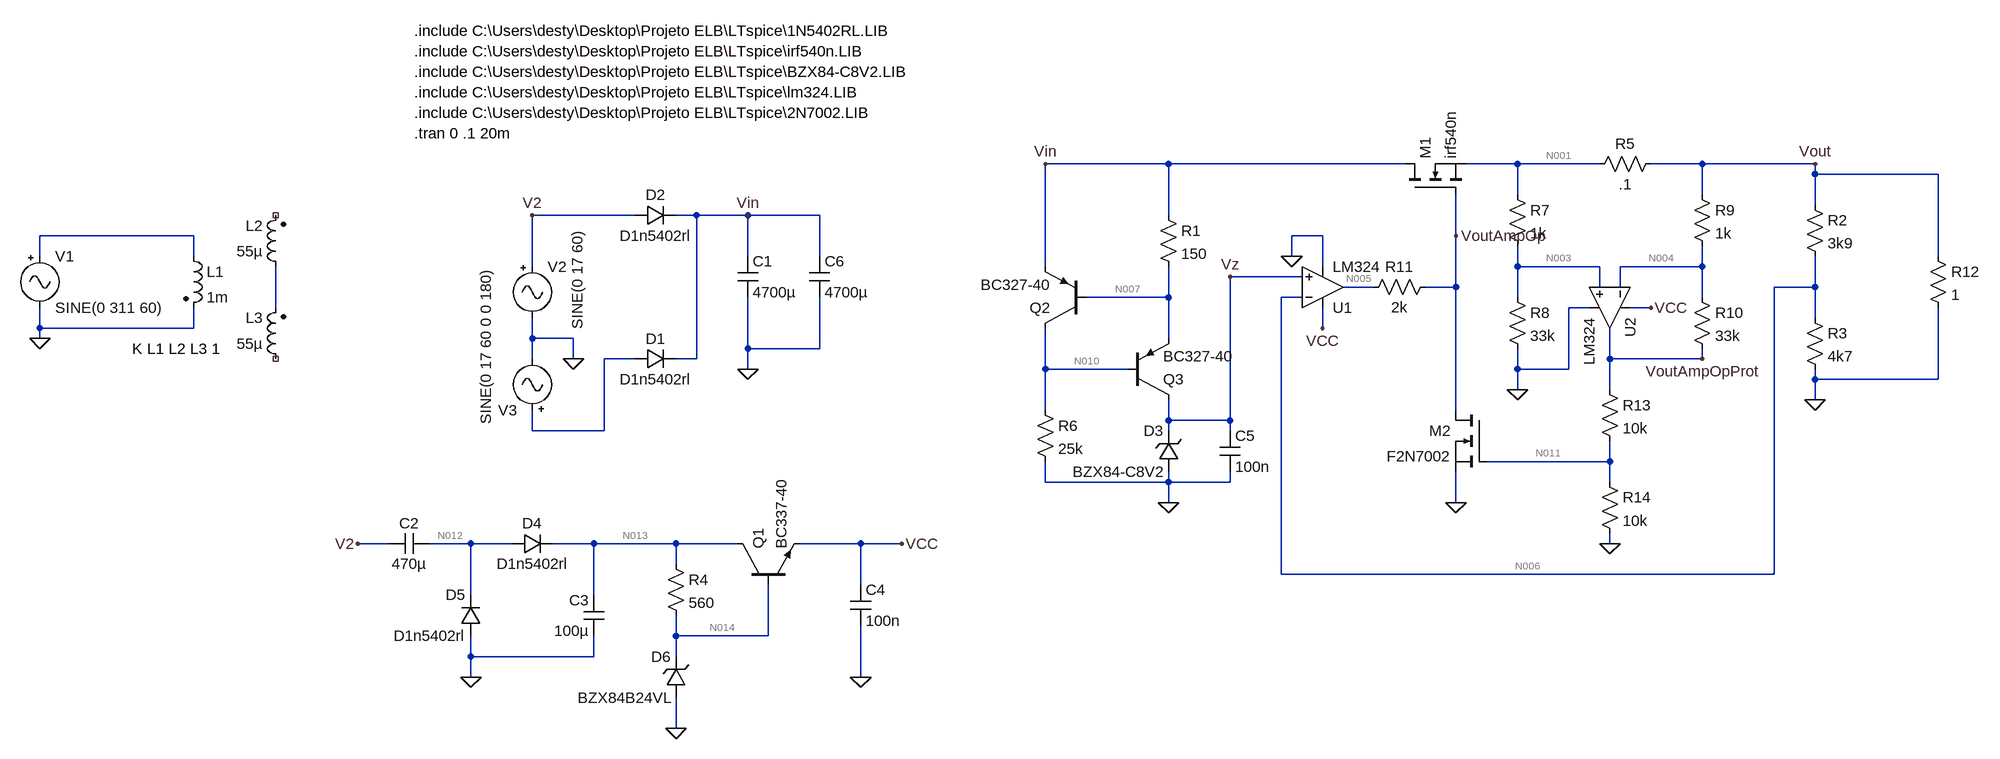
[diagram p0: schematic Projeto ELB.asc]
Projeto ELB.asc, the LTspice schematic file:
Version 4
SHEET 1 2556 872
WIRE 1280 -32 1088 -32
WIRE 1648 -32 1280 -32
WIRE 1824 -32 1744 -32
WIRE 1952 -32 1824 -32
WIRE 2112 -32 2032 -32
WIRE 2288 -32 2112 -32
WIRE 2288 -16 2288 -32
WIRE 2480 -16 2288 -16
WIRE 1824 16 1824 -32
WIRE 2112 16 2112 -32
WIRE 2288 32 2288 -16
WIRE 448 48 288 48
WIRE 544 48 512 48
WIRE 624 48 544 48
WIRE 736 48 624 48
WIRE 1280 48 1280 -32
WIRE -240 80 -480 80
WIRE 1520 80 1472 80
WIRE 1728 80 1728 16
WIRE -480 112 -480 80
WIRE -240 112 -240 80
WIRE 624 112 624 48
WIRE 736 112 736 48
WIRE 1472 112 1472 80
WIRE 2480 112 2480 -16
WIRE 288 128 288 48
WIRE 1088 128 1088 -32
WIRE 1520 128 1520 80
WIRE 1824 128 1824 96
WIRE 1952 128 1824 128
WIRE 2112 128 2112 96
WIRE 2112 128 1984 128
WIRE 1488 144 1376 144
WIRE 1600 160 1552 160
WIRE 1728 160 1728 80
WIRE 1728 160 1680 160
WIRE 1952 160 1952 128
WIRE 1984 160 1984 128
WIRE 2288 160 2288 112
WIRE 2288 160 2224 160
WIRE 1280 176 1280 128
WIRE 1280 176 1152 176
WIRE 1488 176 1456 176
WIRE 1824 176 1824 128
WIRE 2112 176 2112 128
WIRE -112 192 -112 128
WIRE 1936 192 1904 192
WIRE 2032 192 2000 192
WIRE 2288 208 2288 160
WIRE -480 224 -480 192
WIRE -240 224 -240 192
WIRE -240 224 -480 224
WIRE 1520 224 1520 192
WIRE -480 240 -480 224
WIRE 288 240 288 208
WIRE 352 240 288 240
WIRE 1280 240 1280 176
WIRE 624 256 624 176
WIRE 736 256 736 176
WIRE 736 256 624 256
WIRE 288 272 288 240
WIRE 352 272 352 240
WIRE 448 272 400 272
WIRE 544 272 544 48
WIRE 544 272 512 272
WIRE 1968 272 1968 224
WIRE 2112 272 2112 256
WIRE 2112 272 1968 272
WIRE 624 288 624 256
WIRE 1088 288 1088 224
WIRE 1216 288 1088 288
WIRE 1824 288 1824 256
WIRE 1904 288 1904 192
WIRE 1904 288 1824 288
WIRE 2288 304 2288 288
WIRE 2480 304 2480 192
WIRE 2480 304 2288 304
WIRE 1824 320 1824 288
WIRE 1968 320 1968 272
WIRE 2288 336 2288 304
WIRE 1088 352 1088 288
WIRE 1728 352 1728 160
WIRE 1280 368 1280 336
WIRE 1376 368 1376 144
WIRE 1376 368 1280 368
WIRE 288 384 288 352
WIRE 400 384 400 272
WIRE 400 384 288 384
WIRE 1280 384 1280 368
WIRE 1376 384 1376 368
WIRE 1968 432 1968 400
WIRE 1968 432 1776 432
WIRE 1088 464 1088 432
WIRE 1280 464 1280 448
WIRE 1280 464 1088 464
WIRE 1376 464 1376 448
WIRE 1376 464 1280 464
WIRE 1968 464 1968 432
WIRE 1280 496 1280 464
WIRE 1728 496 1728 448
WIRE 64 560 16 560
WIRE 192 560 128 560
WIRE 256 560 192 560
WIRE 384 560 320 560
WIRE 512 560 384 560
WIRE 608 560 512 560
WIRE 800 560 704 560
WIRE 864 560 800 560
WIRE 1968 560 1968 544
WIRE 512 592 512 560
WIRE 1456 608 1456 176
WIRE 2224 608 2224 160
WIRE 2224 608 1456 608
WIRE 800 624 800 560
WIRE 192 640 192 560
WIRE 384 640 384 560
WIRE 512 704 512 672
WIRE 656 704 656 624
WIRE 656 704 512 704
WIRE 192 736 192 704
WIRE 384 736 384 704
WIRE 384 736 192 736
WIRE 512 736 512 704
WIRE 192 768 192 736
WIRE 800 768 800 688
WIRE 512 848 512 800
FLAG 352 272 0
FLAG 624 288 0
FLAG 624 48 Vin
FLAG 1520 224 VCC
FLAG 1088 -32 Vin
FLAG 2288 -32 Vout
FLAG 1280 496 0
FLAG 2288 336 0
FLAG -480 240 0
FLAG 1472 112 0
FLAG 192 768 0
FLAG 288 48 V2
FLAG 16 560 V2
FLAG 864 560 VCC
FLAG 1728 80 VoutAmpOp
FLAG 512 848 0
FLAG 800 768 0
FLAG 1824 320 0
FLAG 2032 192 VCC
FLAG 1728 496 0
FLAG 1968 560 0
FLAG 1376 144 Vz
FLAG 2112 272 VoutAmpOpProt
SYMBOL Misc\\signal -480 96 R0
WINDOW 123 0 0 Left 0
WINDOW 39 0 0 Left 0
SYMATTR InstName V1
SYMATTR Value SINE(0 311 60)
SYMBOL ind2 -256 96 R0
SYMATTR InstName L1
SYMATTR Type ind
SYMATTR Value 1m
SYMATTR SpiceLine Rser=1
SYMBOL ind2 -96 144 R180
WINDOW 0 36 80 Left 2
WINDOW 3 36 40 Left 2
SYMATTR InstName L2
SYMATTR Value 55µ
SYMATTR Type ind
SYMATTR SpiceLine Rser=0
SYMBOL ind2 -96 288 R180
WINDOW 0 36 80 Left 2
WINDOW 3 36 40 Left 2
SYMATTR InstName L3
SYMATTR Value 55µ
SYMATTR Type ind
SYMATTR SpiceLine Rser=0
SYMBOL diode 448 288 R270
WINDOW 0 32 32 VTop 2
WINDOW 3 0 32 VBottom 2
SYMATTR InstName D1
SYMATTR Value D1n5402rl
SYMBOL diode 448 64 R270
WINDOW 0 32 32 VTop 2
WINDOW 3 0 32 VBottom 2
SYMATTR InstName D2
SYMATTR Value D1n5402rl
SYMBOL cap 608 112 R0
SYMATTR InstName C1
SYMATTR Value 4700µ
SYMBOL res 1264 32 R0
SYMATTR InstName R1
SYMATTR Value 150
SYMBOL nmos 1648 16 R270
SYMATTR InstName M1
SYMATTR Value irf540n
SYMATTR Prefix X
SYMBOL res 2272 16 R0
SYMATTR InstName R2
SYMATTR Value 3k9
SYMBOL res 2272 192 R0
SYMATTR InstName R3
SYMATTR Value 4k7
SYMBOL OpAmps\\opamp2 1520 224 M180
SYMATTR InstName U1
SYMATTR Value LM324
SYMBOL Misc\\signal 288 112 R0
WINDOW 123 0 0 Left 0
WINDOW 39 0 0 Left 0
WINDOW 3 70 114 VLeft 2
SYMATTR Value SINE(0 17 60)
SYMATTR InstName V2
SYMBOL cap 128 544 R90
WINDOW 0 0 32 VBottom 2
WINDOW 3 32 32 VTop 2
SYMATTR InstName C2
SYMATTR Value 470µ
SYMBOL cap 400 704 R180
WINDOW 0 24 56 Left 2
WINDOW 3 24 8 Left 2
SYMATTR InstName C3
SYMATTR Value 100µ
SYMBOL diode 256 576 R270
WINDOW 0 32 32 VTop 2
WINDOW 3 0 32 VBottom 2
SYMATTR InstName D4
SYMATTR Value D1n5402rl
SYMBOL diode 208 704 R180
WINDOW 0 24 64 Left 2
WINDOW 3 24 0 Left 2
SYMATTR InstName D5
SYMATTR Value D1n5402rl
SYMBOL res 496 576 R0
SYMATTR InstName R4
SYMATTR Value 560
SYMBOL zener 528 800 R180
WINDOW 0 24 64 Left 2
WINDOW 3 24 0 Left 2
SYMATTR InstName D6
SYMATTR Value BZX84B24VL
SYMBOL npn 608 624 R270
SYMATTR InstName Q1
SYMATTR Value BC337-40
SYMBOL cap 784 624 R0
SYMATTR InstName C4
SYMATTR Value 100n
SYMBOL pnp 1152 224 R180
SYMATTR InstName Q2
SYMATTR Value BC327-40
SYMBOL pnp 1216 336 M180
SYMATTR InstName Q3
SYMATTR Value BC327-40
SYMBOL res 1072 336 R0
SYMATTR InstName R6
SYMATTR Value 25k
SYMBOL cap 1360 384 R0
SYMATTR InstName C5
SYMATTR Value 100n
SYMBOL zener 1296 448 R180
WINDOW 0 24 64 Left 2
WINDOW 3 24 0 Left 2
SYMATTR InstName D3
SYMATTR Value BZX84-C8V2
SYMATTR Prefix X
SYMBOL res 2048 -48 R90
WINDOW 0 0 56 VBottom 2
WINDOW 3 32 56 VTop 2
SYMATTR InstName R5
SYMATTR Value .1
SYMBOL res 1808 0 R0
SYMATTR InstName R7
SYMATTR Value 1k
SYMBOL res 1808 160 R0
SYMATTR InstName R8
SYMATTR Value 33k
SYMBOL res 2096 0 R0
SYMATTR InstName R9
SYMATTR Value 1k
SYMBOL res 2096 160 R0
SYMATTR InstName R10
SYMATTR Value 33k
SYMBOL OpAmps\\opamp2 2032 192 R90
SYMATTR InstName U2
SYMATTR Value LM324
SYMBOL nmos 1776 352 M0
SYMATTR InstName M2
SYMATTR Value F2N7002
SYMATTR Prefix X
SYMBOL res 1696 144 R90
WINDOW 0 0 56 VBottom 2
WINDOW 3 32 56 VTop 2
SYMATTR InstName R11
SYMATTR Value 2k
SYMBOL res 2464 96 R0
SYMATTR InstName R12
SYMATTR Value 1
SYMBOL res 1952 304 R0
SYMATTR InstName R13
SYMATTR Value 10k
SYMBOL res 1952 448 R0
SYMATTR InstName R14
SYMATTR Value 10k
SYMBOL Misc\\signal 288 368 R180
WINDOW 123 0 0 Left 0
WINDOW 39 0 0 Left 0
WINDOW 3 73 234 VLeft 2
SYMATTR Value SINE(0 17 60 0 0 180)
SYMATTR InstName V3
SYMBOL cap 720 112 R0
SYMATTR InstName C6
SYMATTR Value 4700µ
TEXT -336 256 Left 2 !K L1 L2 L3 1
TEXT 104 -80 Left 2 !.tran 0 .1 20m
TEXT 104 -144 Left 2 !.include C:\\Users\\desty\\Desktop\\Projeto ELB\\LTspice\\lm324.LIB
TEXT 104 -176 Left 2 !.include C:\\Users\\desty\\Desktop\\Projeto ELB\\LTspice\\BZX84-C8V2.LIB
TEXT 104 -208 Left 2 !.include C:\\Users\\desty\\Desktop\\Projeto ELB\\LTspice\\irf540n.LIB
TEXT 104 -240 Left 2 !.include C:\\Users\\desty\\Desktop\\Projeto ELB\\LTspice\\1N5402RL.LIB
TEXT 104 -112 Left 2 !.include C:\\Users\\desty\\Desktop\\Projeto ELB\\LTspice\\2N7002.LIB

The netlist it stands for:
* Projeto ELB.asc
V1 N002 0 SINE(0 311 60)
L1 N002 0 1m Rser=1
L2 N008 NC_01 55µ Rser=0
L3 NC_02 N008 55µ Rser=0
D1 N009 Vin D1n5402rl
D2 V2 Vin D1n5402rl
C1 Vin 0 4700µ
R1 Vin N007 150
XM1 Vin VoutAmpOp N001 irf540n  ; pins D G S
R2 Vout N006 3k9
R3 N006 0 4k7
XU1 Vz N006 VCC 0 N005 LM324  ; pins In+ In- V+ V- OUT
V2 V2 0 SINE(0 17 60)
C2 N012 V2 470µ
C3 0 N013 100µ
D4 N012 N013 D1n5402rl
D5 0 N012 D1n5402rl
R4 N013 N014 560
D6 0 N014 BZX84B24VL
Q1 N013 N014 VCC 0 BC337-40
C4 VCC 0 100n
Q2 N010 N007 Vin 0 BC327-40
Q3 Vz N010 N007 0 BC327-40
R6 N010 0 25k
C5 Vz 0 100n
XD3 0 Vz BZX84-C8V2  ; pins + -
R5 Vout N001 .1
R7 N001 N003 1k
R8 N003 0 33k
R9 Vout N004 1k
R10 N004 VoutAmpOpProt 33k
XU2 N003 N004 VCC 0 VoutAmpOpProt LM324  ; pins In+ In- V+ V- OUT
XM2 VoutAmpOp N011 0 F2N7002  ; pins D G S
R11 VoutAmpOp N005 2k
R12 Vout 0 1
R13 VoutAmpOpProt N011 10k
R14 N011 0 10k
V3 N009 0 SINE(0 17 60 0 0 180)
C6 Vin 0 4700µ
.model D D
.lib standard.dio
.model NPN NPN
.model PNP PNP
.lib standard.bjt
K L1 L2 L3 1
.tran 0 .1 20m
.include C:\Users\desty\Desktop\Projeto ELB\LTspice\lm324.LIB
.include C:\Users\desty\Desktop\Projeto ELB\LTspice\BZX84-C8V2.LIB
.include C:\Users\desty\Desktop\Projeto ELB\LTspice\irf540n.LIB
.include C:\Users\desty\Desktop\Projeto ELB\LTspice\1N5402RL.LIB
.include C:\Users\desty\Desktop\Projeto ELB\LTspice\2N7002.LIB
.backanno
.end

* Results of the author's LTspice run, read from the files saved beside the schematic
* Operating Point, zero values left out:
*   V(vin) = -2.804 µV
*   V(n007) = -2.804 µV
*   V(n001) = -3.395 µV
*   V(voutampop) = -340 mV
*   V(vout) = -3.395 µV
*   V(n006) = -1.856 µV
*   V(vcc) = -978.2 mV
*   V(n005) = -340.1 mV
*   V(vz) = 44.12 mV
*   V(n012) = -275.7 mV
*   V(n013) = -551.4 mV
*   V(n014) = -550.7 mV
*   V(n010) = 23.81 nV
*   V(n003) = -3.296 µV
*   V(n004) = -3.399 mV
*   V(voutampopprot) = -115.4 mV
*   V(n011) = -57.86 mV
*   Ic(Q3) = 1.883 pA
*   Ic(Q1) = 1.313 µA
*   Ib(Q1) = 3.378 nA
*   Ie(Q1) = -1.316 µA
*   I(D6) = 1.298 µA
*   I(D5) = 18.06 nA
*   I(D4) = 18.06 nA
*   I(R14) = -5.786 µA
*   I(R13) = -5.758 µA
*   I(R12) = -3.395 µA
*   I(R11) = 53.81 nA
*   I(R10) = 3.395 µA
*   I(R9) = 3.395 µA
*   I(R8) = -99.86 pA
*   I(R7) = -99.32 pA
*   I(R5) = -99.91 pA
*   I(R4) = -1.295 µA
*   I(R3) = -395 pA
*   I(R2) = -394.5 pA
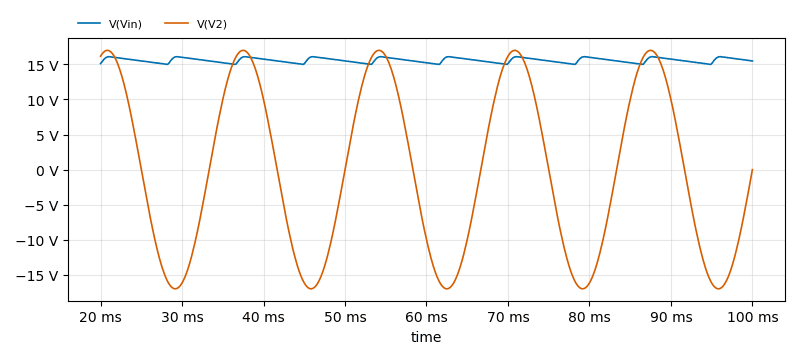
[diagram p1: Transient Analysis of Projeto ELB.asc, plotted from the saved traces]
* Transient Analysis, 1 run:
*   V(Vin): min 14.99 V, max 16.1 V, average 15.58 V, rms 15.58 V, last 15.49 V
*   V(V2): min -17 V, max 17 V, average -390.4 mV, rms 12.09 V, last 0 V